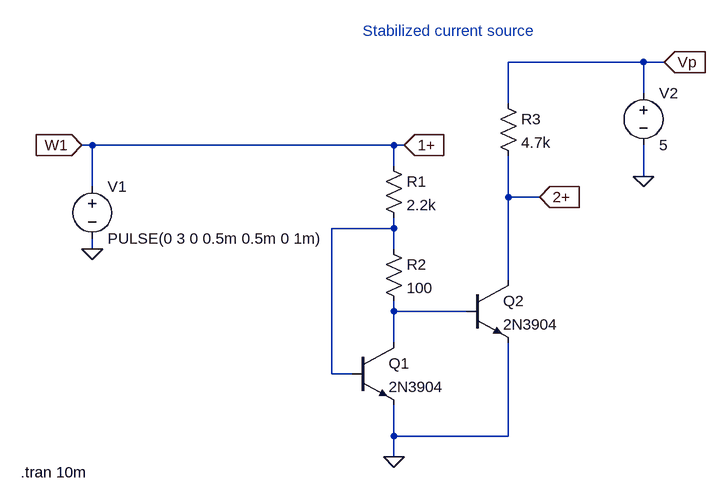
[diagram p0: schematic stabil_csource.asc]
stabil_csource.asc, the LTspice schematic file:
Version 4
SHEET 1 880 680
WIRE 416 -96 208 -96
WIRE 448 -96 416 -96
WIRE 416 -48 416 -96
WIRE 208 -32 208 -96
WIRE -432 32 -448 32
WIRE 32 32 -432 32
WIRE 48 32 32 32
WIRE 32 64 32 32
WIRE 416 80 416 32
WIRE -432 96 -432 32
WIRE 208 112 208 48
WIRE 256 112 208 112
WIRE 32 160 32 144
WIRE 32 160 -64 160
WIRE -432 192 -432 176
WIRE 32 192 32 160
WIRE 208 240 208 112
WIRE 32 288 32 272
WIRE 144 288 32 288
WIRE 32 336 32 288
WIRE -64 384 -64 160
WIRE -32 384 -64 384
WIRE 32 480 32 432
WIRE 208 480 208 336
WIRE 208 480 32 480
WIRE 32 512 32 480
FLAG 32 512 0
FLAG -432 192 0
FLAG 416 80 0
FLAG 256 112 2+
IOPIN 256 112 In
FLAG 48 32 1+
IOPIN 48 32 In
FLAG -448 32 W1
IOPIN -448 32 In
FLAG 448 -96 Vp
IOPIN 448 -96 In
SYMBOL res 16 48 R0
SYMATTR InstName R1
SYMATTR Value 2.2k
SYMBOL res 16 176 R0
SYMATTR InstName R2
SYMATTR Value 100
SYMBOL res 192 -48 R0
SYMATTR InstName R3
SYMATTR Value 4.7k
SYMBOL npn -32 336 R0
SYMATTR InstName Q1
SYMATTR Value 2N3904
SYMBOL npn 144 240 R0
SYMATTR InstName Q2
SYMATTR Value 2N3904
SYMBOL voltage -432 80 R0
WINDOW 123 0 0 Left 0
WINDOW 39 0 0 Left 0
SYMATTR InstName V1
SYMATTR Value PULSE(0 3 0 0.5m 0.5m 0 1m)
SYMBOL voltage 416 -64 R0
WINDOW 123 0 0 Left 0
WINDOW 39 0 0 Left 0
SYMATTR InstName V2
SYMATTR Value 5
TEXT -542 536 Left 2 !.tran 10m
TEXT -16 -144 Left 2 ;Stabilized current source

The netlist it stands for:
* stabil_csource.asc
R1 W1 N001 2.2k
R2 N001 N002 100
R3 Vp 2+ 4.7k
Q1 N002 N001 0 0 2N3904
Q2 2+ N002 0 0 2N3904
V1 W1 0 PULSE(0 3 0 0.5m 0.5m 0 1m)
V2 Vp 0 5
.model NPN NPN
.model PNP PNP
.lib standard.bjt
.tran 10m
* Stabilized current source
.backanno
.end